# EAGLE design YiyoLinkCC1111BMD200 (EAGLE 7.6.0)
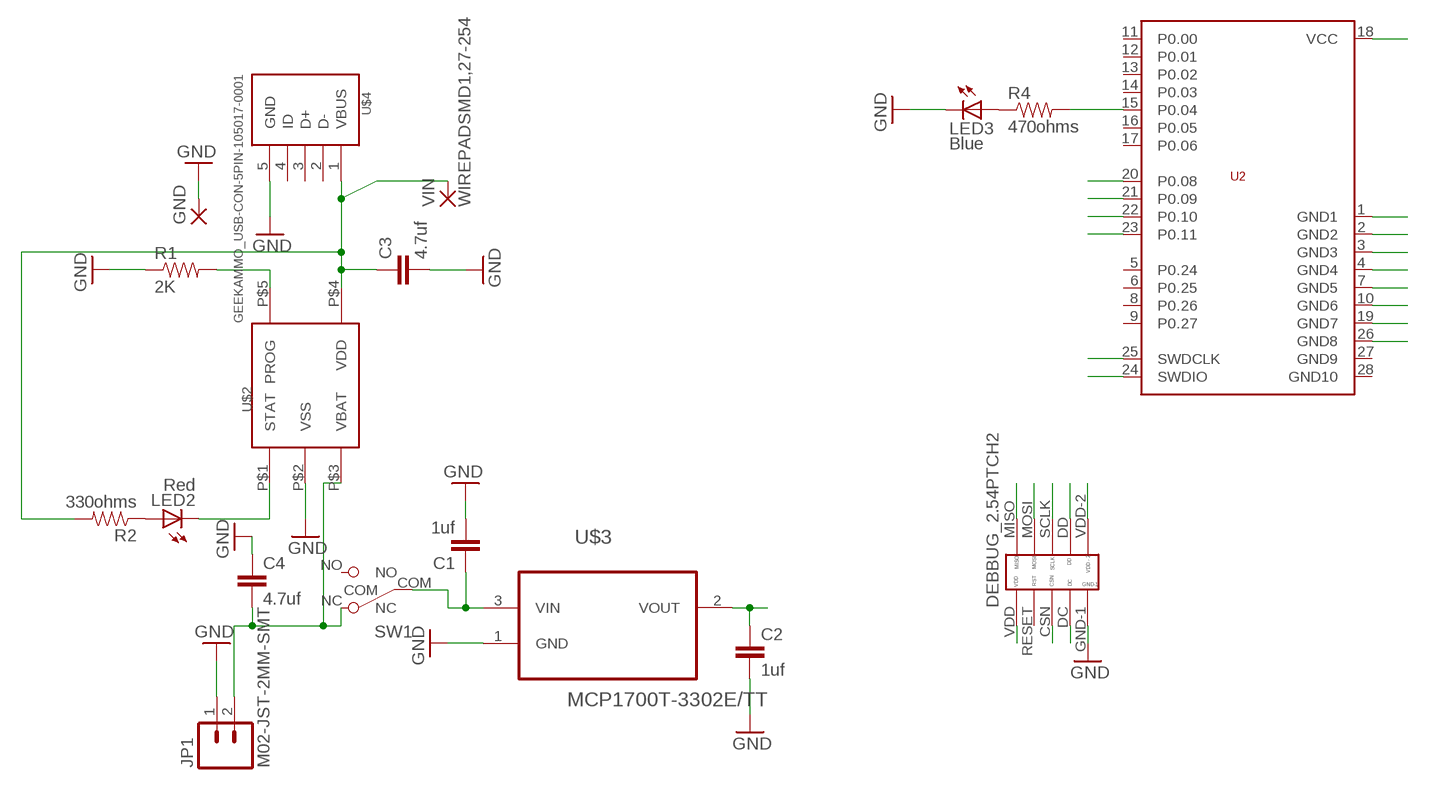
[diagram p0: schematic, sheet 1]

## Parts
C1  1uf  1UF-25V-10%(0805)"  [0805-CAP]
C2  1uf  1UF-25V-10%(0805)"  [0805-CAP]
C3  4.7uf  CAP0805  [0805]
C4  4.7uf  CAP0805  [0805]
DEBBUG_2.54PTCH2  YIYOSLIBRARY_5X2_HEADER  [YIYOSLIBRARY_5X2_FEMALE_HEADER]
GND  WIREPADSMD1,27-254  [SMD1,27-2,54]
JP1  M02-JST-2MM-SMT  [JST-2-SMD]
LED2  Red  LEDSML0805  [SML0805]
LED3  Blue  LEDSML0805  [SML0805]
R1  2K  RESISTOR0805-RES  [0805]
R2  330ohms  RESISTOR0805-RES  [0805]
R4  470ohms  RESISTOR0805-RES  [0805]
SW1  SW_SLIDE  [SLIDE_SWITCH_SMD]
U2  BMD-200  [BMD-200]
U$2  MCP73831  [5PIN_SOT23]
U$3  MCP1700T-3302E/TT  [SOT95P237X112-3N]
U$4  GEEKAMMO_USB-CON-5PIN-105017-0001  [GEEKAMMO_USB-MICRO-MOLEX-105017-0001]
VIN  WIREPADSMD1,27-254  [SMD1,27-2,54]

## Nets
CSN: DEBBUG_2.54PTCH2.CSN U2.20(P0.08)
DC: DEBBUG_2.54PTCH2.DC U2.25(SWDCLK)
DD: DEBBUG_2.54PTCH2.DD U2.24(SWDIO)
GND: C1.2 C2.2 C3.2 C4.1 DEBBUG_2.54PTCH2.GND-1 GND.1(P) JP1.1 LED3.C R1.1 U2.1(GND1) U2.2(GND2) U2.3(GND3) U2.4(GND4) U2.7(GND5) U2.10(GND6) U2.19(GND7) U2.26(GND8) U$2.P$2(VSS) U$3.1(GND) U$4.5(GND)
MISO: DEBBUG_2.54PTCH2.MISO U2.22(P0.10)
MOSI: DEBBUG_2.54PTCH2.MOSI U2.21(P0.09)
N$2: LED3.A R4.1
N$3: R4.2 U2.15(P0.04)
N$5: LED2.A R2.1
N$6: C3.1 R2.2 U$2.P$4(VDD) U$4.1(VBUS) VIN.1(P)
N$7: R1.2 U$2.P$5(PROG)
N$8: C4.2 JP1.2 SW1.NC U$2.P$3(VBAT)
N$9: C1.1 SW1.COM U$3.3(VIN)
N$10: LED2.C U$2.P$1(STAT)
SCLK: DEBBUG_2.54PTCH2.SCLK U2.23(P0.11)
VDDO: C2.1 DEBBUG_2.54PTCH2.VDD DEBBUG_2.54PTCH2.VDD-2 U2.18(VCC) U$3.2(VOUT)
Unconnected: DEBBUG_2.54PTCH2.RESET(RST) SW1.NO U2.5(P0.24) U2.6(P0.25) U2.8(P0.26) U2.9(P0.27) U2.11(P0.00) U2.12(P0.01) U2.13(P0.02) U2.14(P0.03) U2.16(P0.05) U2.17(P0.06) U2.27(GND9) U2.28(GND10) U$4.2(D-) U$4.3(D+) U$4.4(ID)

## Library data of the parts
C1 C2 = SparkFun-Capacitors:1UF-25V-10%(0805): CAP-08064
C3 C4 = SparkFun-Capacitors:CAP: Capacitor Standard 0603 ceramic capacitor, and 0.1" leaded capacitor.
DEBBUG_2.54PTCH2 = YiyoLinkCC1111:YIYOSLIBRARY_5X2_HEADER
GND VIN = wirepad:WIREPAD: Wire PAD connect wire on PCB
JP1 = SparkFun-Connectors:M02: Standard 2-pin 0.1" header. Use with - straight break away headers ( PRT-00116) - right angle break away headers (PRT-00553) - swiss pins (PRT-00743) - machine pins (PRT-00117) - female headers (PRT-00115) Molex polarized connector foot print use with: PRT-08233 with associated crimp pins and housings. 2.54_SCREWTERM for use with PRT-10571. 3.5mm Screw Terminal footprints for PRT-08084 5mm Screw Terminal footprints for use with PRT-08432; PROD_ID: CONN-08352
LED2 LED3 = led:LED: LED OSRAM: - CHIPLED LG R971, LG N971, LY N971, LG Q971, LY Q971, LO R971, LY R971 LH N974, LH R974 LS Q976, LO Q976, LY Q976 LO Q996 - Hyper CHIPLED LW Q18S LB Q993, LB Q99A, LB R99A - SideLED LS A670, LO A670, LY A670, LG A670, LP A670 LB A673, LV A673, LT A673, LW A673 LH A674 LY A675 LS A676, LA A676, LO A676, LY A676, LW A676 LS A679, LY A679, LG A679 - Hyper Micro SIDELED® LS Y876, LA Y876, LO Y876, LY Y876 LT Y87S - SmartLED LW L88C, LW L88S LB L89C, LB L89S, LG L890 LS L89K, LO L89K, LY L89K LS L896, LA L896, LO L896, LY L896 - TOPLED LS T670, LO T670, LY T670, LG T670, LP T670 LSG T670, LSP T670, LSY T670, LOP T670, LYG T670 LG T671, LOG T671, LSG T671 LB T673, LV T673, LT T673, LW T673 LH T674 LS T676, LA T676, LO T676, LY T676, LB T676, LH T676, LSB T676, LW T676 LB T67C, LV T67C, LT T67C, LS T67K, LO T67K, LY T67K, LW E67C LS E67B, LA E67B, LO E67B, LY E67B, LB E67C, LV E67C, LT E67C LW T67C LS T679, LY T679, LG T679 LS T770, LO T770, LY T770, LG T770, LP T770 LB T773, LV T773, LT T773, LW T773 LH T774 LS E675, LA E675, LY E675, LS T675 LS T776, LA T776, LO T776, LY T776, LB T776 LHGB T686 LT T68C, LB T68C - Hyper Mini TOPLED® LB M676 - Mini TOPLED Santana® LG M470 LS M47K, LO M47K, LY M47K Source: http://www.osram.convergy.de LUXEON: - LUMILED® LXK2-PW12-R00, LXK2-PW12-S00, LXK2-PW14-U00, LXK2-PW14-V00 LXK2-PM12-R00, LXK2-PM12-S00, LXK2-PM14-U00 LXK2-PE12-Q00, LXK2-PE12-R00, LXK2-PE12-S00, LXK2-PE14-T00, LXK2-PE14-U00 LXK2-PB12-K00, LXK2-PB12-L00, LXK2-PB12-M00, LXK2-PB14-N00, LXK2-PB14-P00, LXK2-PB14-Q00 LXK2-PR12-L00, LXK2-PR12-M00, LXK2-PR14-Q00, LXK2-PR14-R00 LXK2-PD12-Q00, LXK2-PD12-R00, LXK2-PD12-S00 LXK2-PH12-R00, LXK2-PH12-S00 LXK2-PL12-P00, LXK2-PL12-Q00, LXK2-PL12-R00 Source: www.luxeon.com KINGBRIGHT: KA-3528ASYC Source: www.kingbright.com
R1 R2 R4 = SparkFun-Resistors:RESISTOR: Resistor Basic schematic elements and footprints for 0603, 1206, and PTH resistors.
SW1 = parts:SW_SLIDE
U2 = BMD-200:BMD-200
U$2 = parts:MCP73831: Digikey No:- __MCP73831T-2ACI/OTCT-ND__
U$3 = microchip-Complemento:MCP1700T-3302E/TT: Low Quiescent Current LDO; MPN: MCP1700T-3302E/TT; OC_FARNELL: 1296592; OC_NEWARK: 88H9817; PACKAGE: SOT23-3; SUPPLIER: Microchip
U$4 = YiyoLinkCC1111:GEEKAMMO_USB-CON-5PIN: Molex Micro USB 105017-0001

## Board
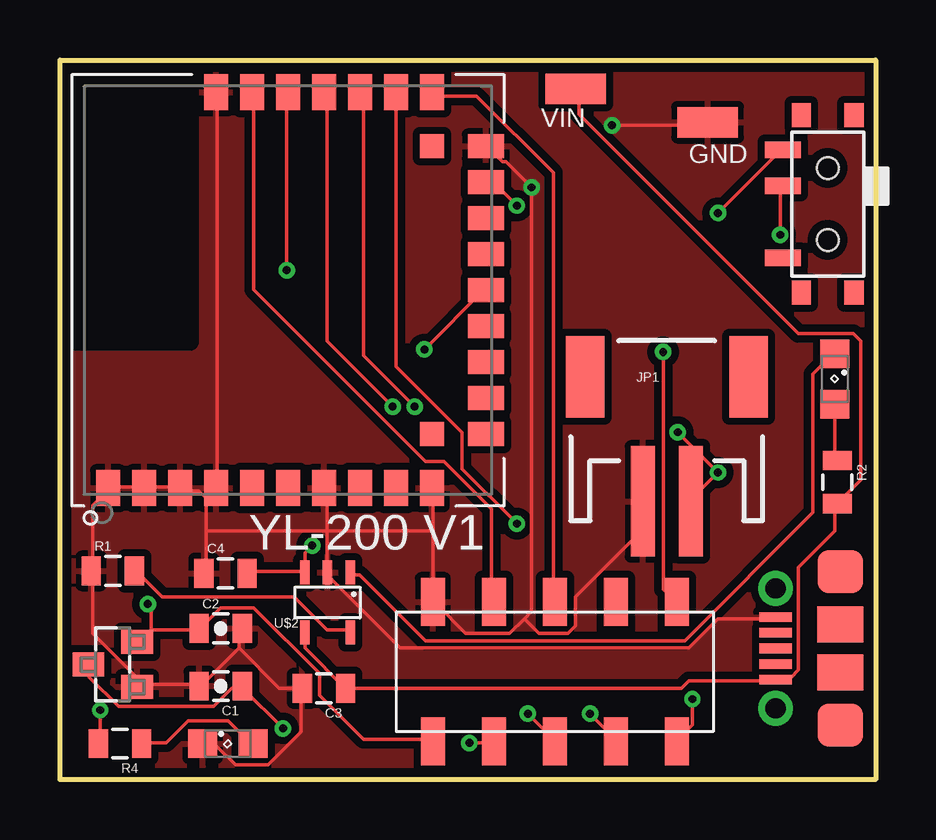
[diagram p1: board, top side]
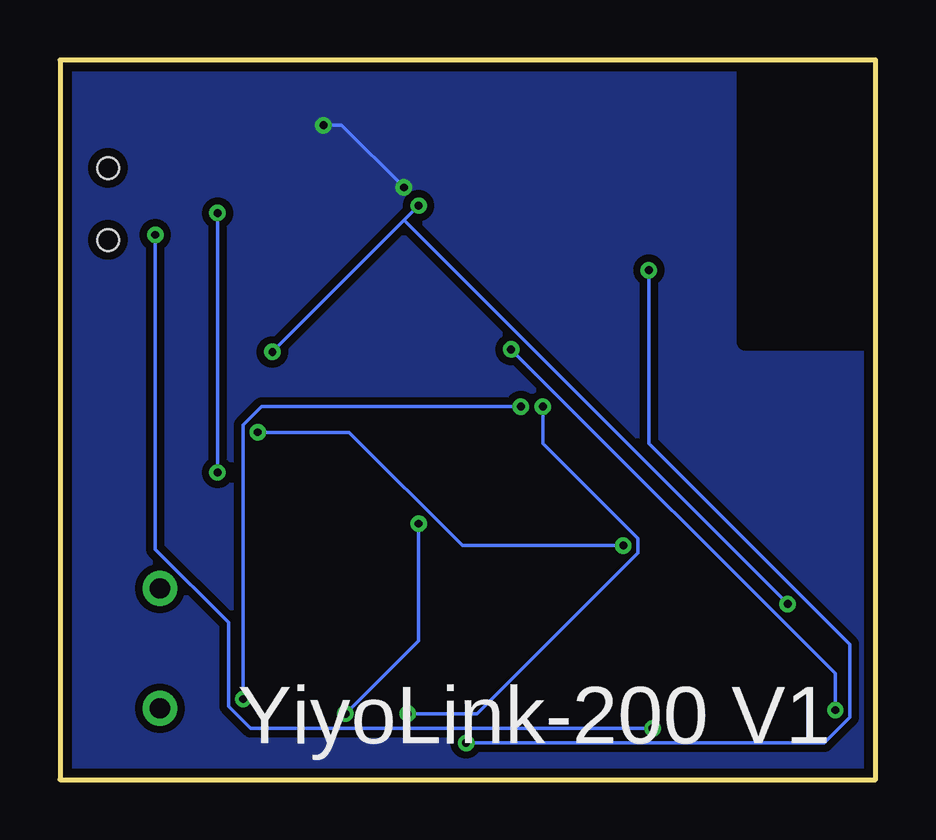
[diagram p2: board, bottom side, seen from below]

Size 34 x 30 mm. Coordinates in mm from the lower left corner, seen from the top.
Outline: 0,0 0,30 34,30 34,0 0,0
Copper layers (1*16): Top 0.0356mm / dielectric 1.5011mm / Bottom 0.0356mm
Design rules "oshpark-2layer *": minimum track width 6mil, minimum drill 13mil, track to track 6mil, track to pad 6mil, pad to pad 6mil, via to via 6mil, smd to smd 6mil, copper to edge 15mil, drill to drill 6mil, minimum pad ring 7mil, minimum via ring 7mil, stop-mask expansion 2.5mil, vias tented up to drill 20mil, thermal gap 10mil

### Footprints (pad centres in the part's own frame; a part is rotated, then mirrored left to right if it is on the bottom)
0805-CAP = smd 0.8 x 1.2: 1 -0.9,0; 2 0.9,0
0805 = smd 0.8 x 1.2: 1 -0.9,0; 2 0.9,0
YIYOSLIBRARY_5X2_FEMALE_HEADER = smd 1 x 2: CSN 0,-2.9; DC 2.54,-2.9; DD 2.54,2.9; GND-1 5.08,-2.9; MISO -5.08,2.9; MOSI -2.54,2.9; RESET -2.54,-2.9; SCLK 0,2.9; VDD -5.08,-2.9; VDD-2 5.08,2.9
SMD1,27-2,54 = smd 1.27 x 2.54: 1 0,0
JST-2-SMD = smd 1 x 4.6: 1 -1,-3.7; 2 1,-3.7 | smd 1.6 x 3.4: NC1 -3.4,1.5; NC2 3.4,1.5
SML0805 = smd 1.2 x 1.2: A 1.05,0; C -1.05,0
SLIDE_SWITCH_SMD = smd 0.7 x 1.5: COM 0.75,1.875; NC 2.25,1.875; NO -2.25,1.875 | smd 1 x 0.8: P$1 -3.7,-1.1; P$2 -3.7,1.1; P$3 3.7,1.1; P$4 3.7,-1.1 | hole 0.9: -1.5,0; 1.5,0
BMD-200 = smd 1 x 1.5: 1 -7.5,-8.25; 2 -6,-8.25; 3 -4.5,-8.25; 4 -3,-8.25; 5 -1.5,-8.25; 6 0,-8.25; 7 1.5,-8.25; 8 3,-8.25; 9 4.5,-8.25; 10 6,-8.25; 20 6,8.25; 21 4.5,8.25; 22 3,8.25; 23 1.5,8.25; 24 0,8.25; 25 -1.5,8.25; 26 -3,8.25 | smd 1.5 x 1: 11 8.25,-6; 12 8.25,-4.5; 13 8.25,-3; 14 8.25,-1.5; 15 8.25,0; 16 8.25,1.5; 17 8.25,3; 18 8.25,4.5; 19 8.25,6 | smd 1 x 1: 27 6,-6; 28 6,6
5PIN_SOT23 = smd 0.4 x 1: P$1 0.4,-0.63; P$2 1.35,-0.63; P$3 2.3,-0.63; P$4 2.3,1.87; P$5 0.4,1.87
SOT95P237X112-3N = smd 0.991 x 1.321: 1 -0.94,-1.016; 2 0.94,-1.016; 3 0,1.016
GEEKAMMO_USB-MICRO-MOLEX-105017-0001 = smd 0.4 x 1.35: 1 1.2,0; 2 1.85,0; 3 2.5,0; 4 3.15,0; 5 3.8,0 | drill 0.85 pad 1.45: P$1 0,0; P$2 5,0 | smd 1.5 x 1.9: P$3 3.5,-2.7; P$4 1.5,-2.7 | smd 1.8 x 1.9: P$6 5.7,-2.7; P$7 -0.7,-2.7

### Placement (x,y rotation side)
C1  6.7,3.9 180 top
C2  6.7,6.3 0 top
C3  11,3.8 180 top
C4  6.9,8.6 0 top
DEBBUG_2.54PTCH2  20.63,4.5 180 top
GND  27,27.4 270 top
JP1  25.3,15.3 0 top
LED2  32.3,16.7 270 top
LED3  7,1.5 0 top
R1  2.2,8.7 0 top
R2  32.4,12.4 270 top
R4  2.5,1.5 180 top
SW1  32,24 90 top
U2  9.5,20.4 0 top
U$2  12.5,8 180 top
U$3  2.2,4.8 90 top
U$4  29.83,2.97 90 top
VIN  21.5,28.8 90 top

### Tracks (layer width: path | path; a pad name or v marks a point on that pad's centre or on a via)
CSN
  Top 0.152: U2.20 15.54,28.5 17.37,28.5 20.57,25.3 20.57,7.47 DEBBUG_2.54PTCH2.CSN
DC
  Top 0.152: U2.25 8.08,28.5 8.08,20.42 15.24,13.26 16,13.26 17.98,11.28 17.98,7.47 DEBBUG_2.54PTCH2.DC
DD  (via drill 0.33)
  Top 0.152: v9.45,21.23 9.45,28.5 U2.24 | v17.07,1.52 17.98,1.52 DEBBUG_2.54PTCH2.DD
  Bottom 0.152: v9.45,21.23 9.45,14.02 1.07,5.64 1.07,2.59 2.13,1.52 v17.07,1.52
GND  (via drill 0.33)
  Top 0.152: LED3.C 6.1,1.37 6.55,1.37 7.32,0.61 8.69,0.61 10.06,1.98 10.06,3.66 C3.2 10.06,3.81 9.14,3.81 7.47,5.49 | 7.47,5.49 7.47,6.25 C2.2 | 7.47,5.49 5.94,3.96 C1.2 5.79,3.96 3.35,3.96 U$3.1 3.2,3.96 3.2,4.27 1.37,6.1 1.37,8.69 R1.1 1.37,8.84 1.37,11.43 1.98,12.04 U2.1 2.13,12.19 3.35,12.19 U2.2 3.5,12.19 4.88,12.19 U2.3 5.03,12.04 5.79,12.04 6.1,11.73 | 6.1,11.73 6.1,10.36 | 6.1,10.36 6.1,8.69 C4.1 | 6.1,11.73 6.4,12.04 U2.4 | 6.1,11.73 U2.4 | U2.26 6.55,28.5 6.55,12.19 U2.4 | 11.12,10.36 11.12,12.04 U2.7 | 11.12,10.36 11.12,8.69 U$2.P$2 11.12,8.53 14.17,5.49 26.21,5.49 27.43,6.71 29.72,6.71 U$4.5 | 15.54,10.36 15.54,7.47 DEBBUG_2.54PTCH2.GND-1 15.7,7.32 16.92,6.1 18.75,6.1 19.36,6.71 | 15.54,10.36 15.54,12.04 U2.10 | 19.36,6.71 19.66,7.01 v19.66,24.69 18.59,25.76 18.44,25.76 17.83,26.36 U2.19 | v23.01,27.28 26.98,27.28 GND.1 | 19.36,6.71 19.96,6.1 21.18,6.1 21.49,6.4 21.49,7.62 24.23,10.36 24.23,11.58 JP1.1 | 15.54,10.36 11.12,10.36 | 11.12,10.36 6.1,10.36
  Bottom 0.152: v23.01,27.28 22.25,27.28 v19.66,24.69
  pour Top (isolate 0.305): 0,0 34,0 34,30 0,30
  pour Bottom (isolate 0.305): 0,0 34,0 34,30 0,30
MISO  (via drill 0.33)
  Top 0.152: v14.78,15.54 12.65,17.68 12.65,28.5 U2.22 | v26.36,3.35 26.36,2.29 25.76,1.68 DEBBUG_2.54PTCH2.MISO
  Bottom 0.152: v14.78,15.54 25.6,15.54 26.36,14.78 v26.36,3.35
MOSI  (via drill 0.33)
  Top 0.152: v19.05,10.67 16.76,12.95 16.76,14.48 14.02,17.22 14.02,28.5 U2.21 | v22.1,2.74 23.16,1.68 DEBBUG_2.54PTCH2.MOSI
  Bottom 0.152: v19.05,10.67 19.05,5.79 v22.1,2.74
N$2
  Top 0.152: R4.1 3.5,1.52 4.42,1.52 5.33,2.44 7.01,2.44 7.92,1.52 LED3.A
N$3  (via drill 0.33)
  Top 0.152: v1.68,2.9 1.68,1.52 R4.2 | v15.19,17.93 17.68,20.42 U2.15
  Bottom 0.152: v1.68,2.9 1.68,4.42 v15.19,17.93
N$5
  Top 0.152: LED2.A 32.31,15.54 32.31,13.41 R2.1
N$6
  Top 0.152: U$2.P$4 10.21,6.1 10.21,5.49 11.89,3.81 C3.1 12.04,3.81 25.91,3.81 26.21,4.12 29.72,4.12 U$4.1 29.87,4.27 30.48,4.27 30.79,4.57 30.79,8.84 32.31,10.36 32.31,11.43 R2.2 32.46,11.58 33.38,12.5 33.38,18.29 33.07,18.59 30.79,18.59 21.64,27.74 21.64,28.65 VIN.1
N$7
  Top 0.152: U$2.P$5 12.04,6.25 11.12,6.25 9.75,7.62 4.27,7.62 3.2,8.69 R1.2
N$8  (via drill 0.33)
  Top 0.152: C4.2 7.92,8.69 10.06,8.69 U$2.P$3 10.21,8.69 10.21,9.45 v10.52,9.75 | v27.43,23.62 30.02,26.21 SW1.NC | JP1.2 26.36,11.73 v27.43,12.8 v25.76,14.48
  Bottom 0.152: v27.43,12.8 v27.43,23.62 | v10.52,9.75 17.22,9.75 21.95,14.48 v25.76,14.48
N$9  (via drill 0.33)
  Top 0.152: U$3.3 1.22,4.72 1.22,4.27 2.44,3.05 6.4,3.05 7.16,3.81 7.47,3.81 C1.1 7.62,3.81 v9.3,2.13 | v30.02,22.71 30.02,24.69 SW1.COM
  Bottom 0.152: v30.02,22.71 30.02,9.6 26.98,6.55 26.98,3.05 26.06,2.13 v9.3,2.13
N$10
  Top 0.152: U$2.P$1 12.19,8.53 12.5,8.53 15.24,5.79 26.06,5.79 31.39,11.12 31.39,16.92 32.16,17.68 LED2.C
SCLK  (via drill 0.33)
  Top 0.152: v13.87,15.54 11.12,18.29 11.12,28.5 U2.23 | v19.51,2.74 20.57,1.68 DEBBUG_2.54PTCH2.SCLK
  Bottom 0.152: v13.87,15.54 13.87,14.02 9.91,10.06 9.91,9.45 16.61,2.74 v19.51,2.74
VDDO  (via drill 0.33)
  Top 0.152: 3.81,6.25 5.79,6.25 C2.1 5.94,6.4 6.71,7.16 8.08,7.16 10.82,4.42 10.82,3.5 12.65,1.68 15.54,1.68 DEBBUG_2.54PTCH2.VDD-2 | 3.81,6.25 3.35,5.79 U$3.2 | v19.05,23.93 18.14,24.84 17.83,24.84 U2.18 | v25.15,17.83 25.15,7.92 25.6,7.47 DEBBUG_2.54PTCH2.VDD | 3.81,6.25 3.81,7.16 v3.66,7.32
  Bottom 0.152: v25.15,17.83 19.66,23.32 | 19.66,23.32 v19.05,23.93 | 19.66,23.32 v3.66,7.32

### Text on the board
tPlace: YL-200 V1
bPlace: YiyoLink-200 V1